# EasyEDA schematic DD M.json
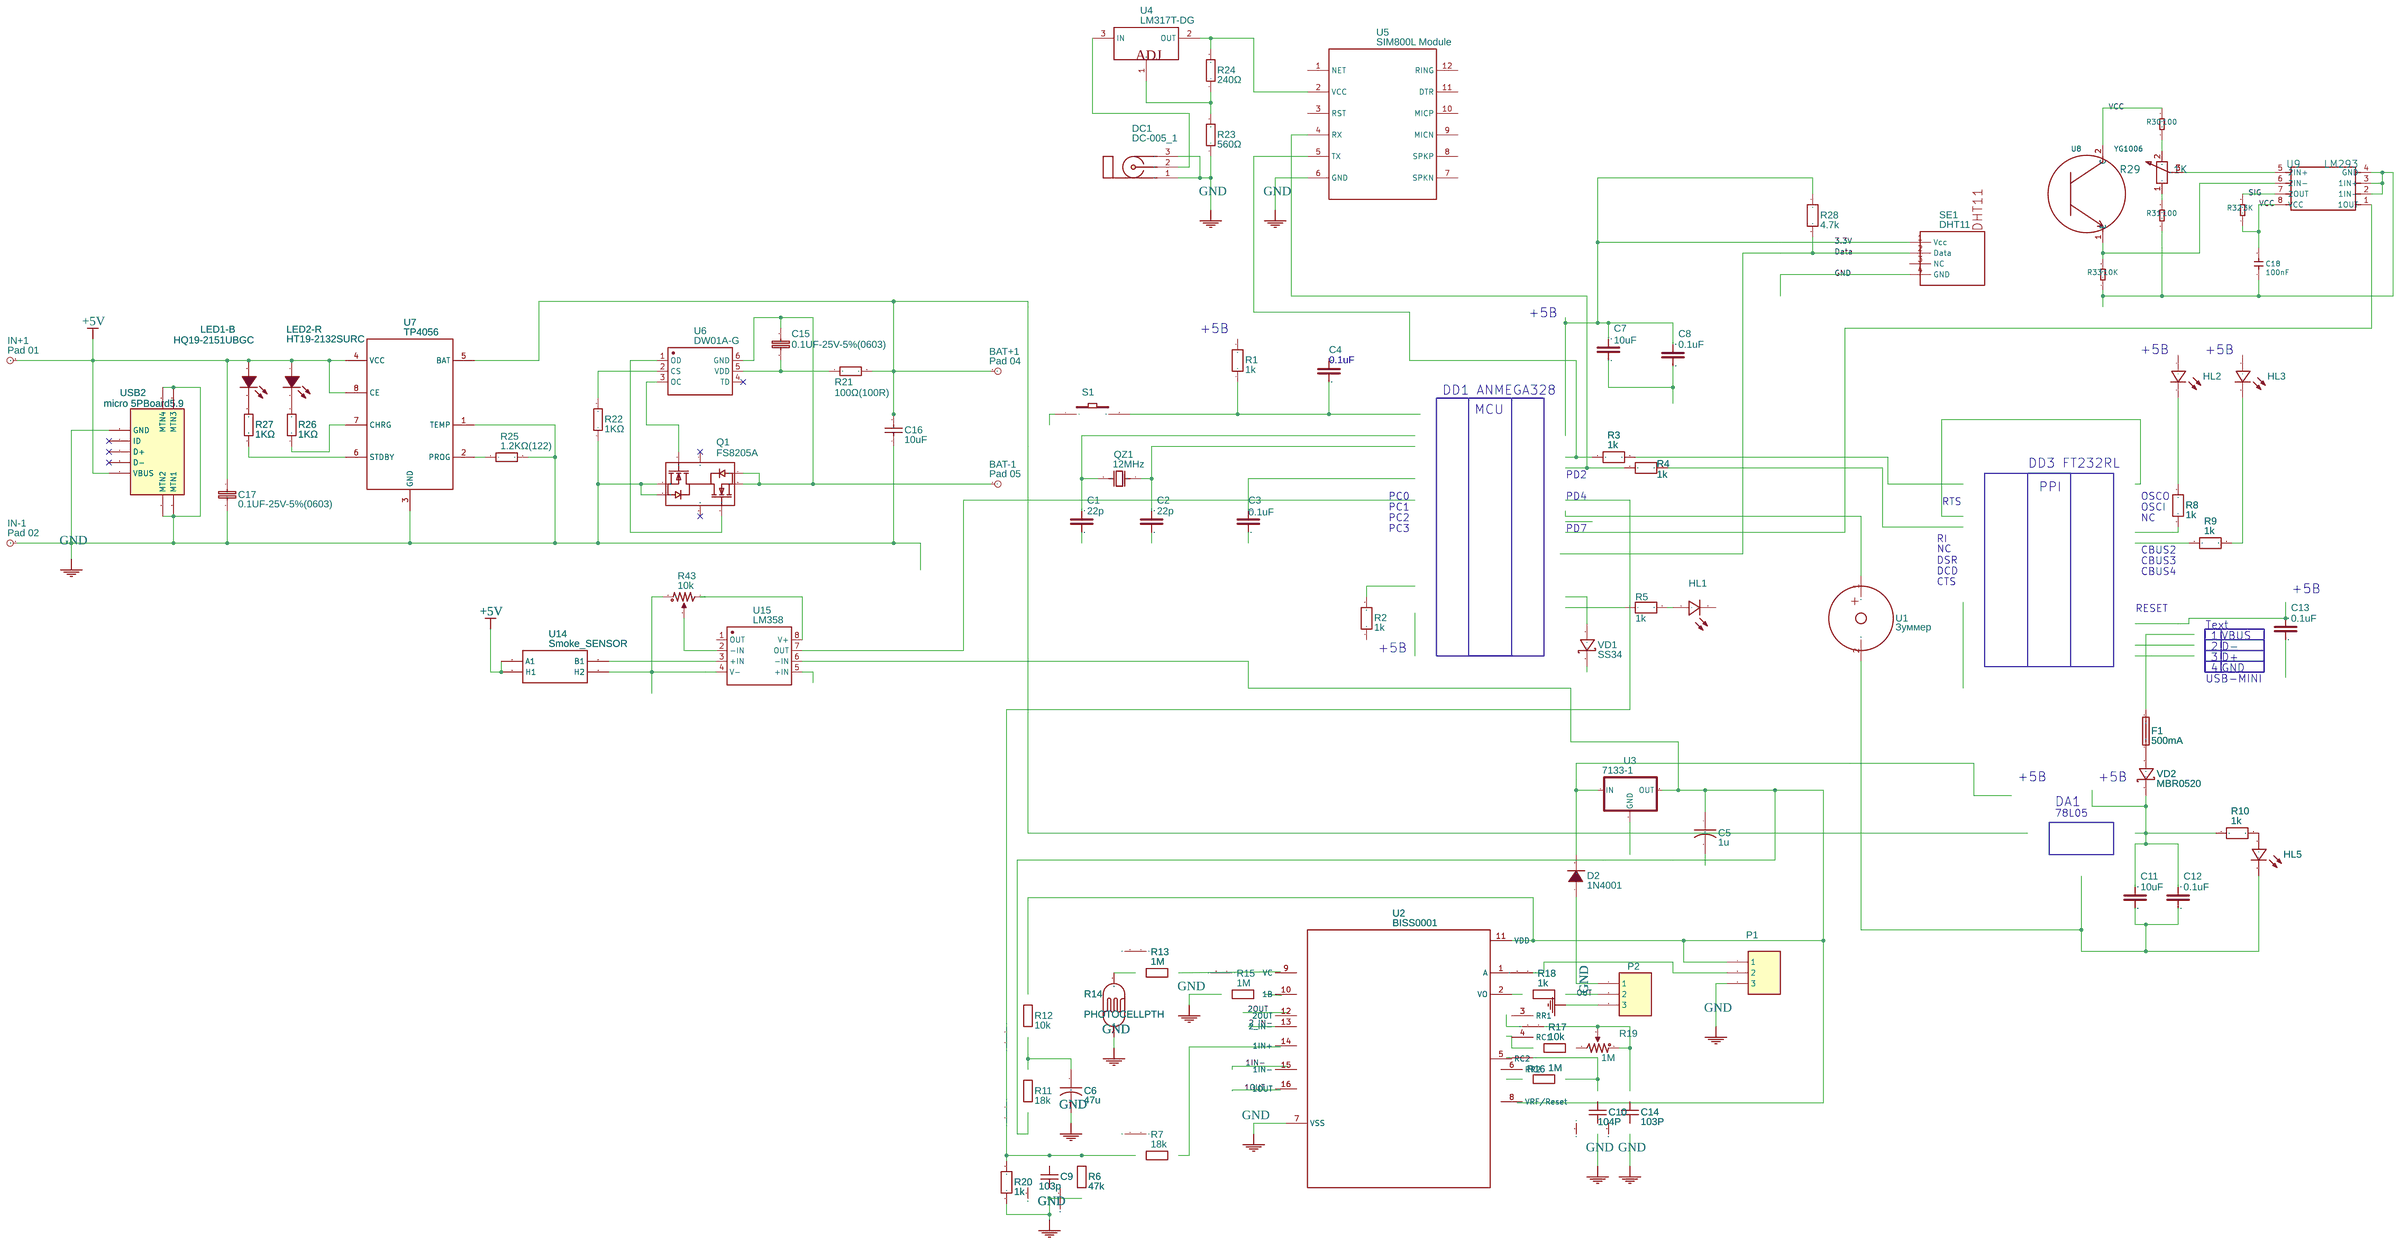
[diagram p0: schematic sheet]

## Parts
BAT+1  Pad 04  [CON_PAD_SQUARE_32MIL]
BAT-1  Pad 05  [CON_PAD_SQUARE_32MIL]
C1  22p  [TWO_IO]
C2  22p  [TWO_IO]
C3  0.1uF  [TWO_IO]
C4  Condensator1  [TWO_IO]
C5  1u  [DO-7]
C6  47u  [DO-7]
C7  10uF  [TWO_IO]
C8  0.1uF  [TWO_IO]
C9  103p  [C1]
C10  104P  [C0805]
C11  10uF  [TWO_IO]
C12  0.1uF  [TWO_IO]
C13  0.1uF  [TWO_IO]
C14  103P  [C0805]
C15  0.1UF-25V-5%(0603)  [0603-CAP]
C16  10uF  [0603]
C17  0.1UF-25V-5%(0603)  [0603-CAP]
C18  100nF  [C0603]
D2  1N4001  [DO35-7]
DC1  DC-005_1  [DC-005]
F1  500mA  [2A-3F-250VAC]
HL1  LED-3MM  [LED-3MM/2.54]
HL2  LED-3MM  [LED-3MM/2.54]
HL3  LED-3MM  [LED-3MM/2.54]
HL5  LED-3MM  [LED-3MM/2.54]
IN+1  Pad 01  [CON_PAD_SQUARE_32MIL]
IN-1  Pad 02  [CON_PAD_SQUARE_32MIL]
LED1-B  HQ19-2151UBGC  [LED-0603]
LED2-R  HT19-2132SURC  [LED-0603]
P1  SIP3  [HDR1X3]
P2  SIP3  [HDR1X3]
Q1  FS8205A  [TSSOP-8_3X4.4X065P]
QZ1  12MHz  [OSC-49S-1]
R1  1k  [AXIAL-0.3]
R2  1k  [AXIAL-0.3]
R3  1k  [AXIAL-0.3]
R4  1k  [AXIAL-0.3]
R5  1k  [AXIAL-0.3]
R6  47k  [C0805]
R7  18k  [C0805]
R8  1k  [AXIAL-0.3]
R9  1k  [AXIAL-0.3]
R10  1k  [AXIAL-0.3]
R11  18k  [C0805]
R12  10k  [C0805]
R13  1M  [C0805]
R14  PHOTOCELLPTH  [PHOTOCELL]
R15  1M  [C0805]
R16  1M  [C0805]
R17  10k  [C0805]
R18  1k  [C0805]
R19  1M  [TRIM_POT_PTH]
R20  1k  [AXIAL-0.3]
R21  100Ω(100R)  [0603]
R22  1KΩ  [0603]
R23  560Ω  [AXIAL-0.4]
R24  240Ω  [AXIAL-0.4]
R25  1.2KΩ(122)  [0603]
R26  1KΩ  [0603]
R27  1KΩ  [0603]
R28  4.7k  [AXIAL-0.3]
R29  1K  [3P-SQUA-7X6.8]
R30  100  [R0603]
R31  100  [R0603]
R32  3K  [R0603]
R33  10K  [R0603]
R43  10k  [TRIM_POT_PTH]
S1  EVQ22705R  [KEY-6.0*6.0-4]
SE1  DHT11  [HDR1X4]
U1  Зуммер  [ЗУММЕР]
U2  BISS0001  [DIP]
U3  7133-1  [SOT23]
U4  LM317T-DG  [TO-220(TO-220-3)]
U5  SIM800L Module  [SIM800L MODULE]
U6  DW01A-G  [SOT-23-6]
U7  TP4056  [SOP-8_EP_150MIL]
U8  YG1006  [2P-2.54-5MM]
U9  LM293  [SOIC8-6.0]
U14  Smoke_SENSOR  [MQ-3]
U15  LM358  [DIP8]
USB2  micro 5PBoard5.9  [MICRO-USB-1]
VD1  SS34  [SMA(DO-214AC)]
VD2  MBR0520  [SMA(DO-214AC)]

## Library data of the parts
BAT+1 BAT-1 IN+1 IN-1 = -: Contributor: DangerousPrototype; Manufacturer Part: ?
C1-C4 C7 C8 C11-C13 = -: Contributor: paulheystee; Manufacturer Part: ?
C5 C6 C9 C10 C14 = Capacitor: Manufacturer Part: ?
C15 C17 = -: Contributor: SparkFun; Manufacturer Part: ?
C16 = 0603X106K160NT: Supplier: LCSC; Manufacturer: FH; Tolerance: ±10%; Rated Voltage: 16V; Supplier Part: C70225
D2 = Diode: Manufacturer Part: ?
DC1 = -: Supplier: EasyEDA; Manufacturer: EasyEDA; Supplier Part: E66437
F1 = -: Supplier: LCSC; Manufacturer Part: Glass tube fuse2A 3F 250VAC; Manufacturer: XCFuse; image: //image.lceda.cn/szlcsc/C71017.jpg; Supplier Part: C71017
HL1-HL3 HL5 = -: Supplier: LCSC; Manufacturer: EVERLIGHT; Manufacturer Part: 204-10SURD/S530-A3; Supplier Part: C99772
LED1-B = -: Supplier: LCSC; Manufacturer: HARVATEK; Contributor: LCSC; Supplier Part: C154450
LED2-R = -: Supplier: LCSC; Manufacturer: HARVATEK; Contributor: LCSC; Supplier Part: C154453
P1 P2 = -: catid: 20; Manufacturer Part: ?
Q1 = -: Supplier: LCSC; Manufacturer: FORTUNE; LCSC Assembly: Yes; image: //image.lceda.cn/szlcsc/C16052.jpg; Supplier Part: C16052
QZ1 = X49SD12MSD2SC: Supplier: LCSC; Manufacturer: YXC; Supplier Part: C16369
R1-R5 R8 R9 R28 = Res_AXIAL-0.3(1/8W)_EU: Manufacturer Part: ?
R6 R7 R11-R13 R15-R18 = Resistor: Manufacturer Part: ?
R10 R20 = Res_AXIAL-0.3(1/8W)_EU
R14 = -: CdS photoresistor. This is a low cost way to detect light levels. Resistance decreases with more incoming light. SparkFun SKU: SEN-09088; catid: 20; Contributor: SparkFun; sourceId: tW8IiSrpZ; Manufacturer Part: ?
R19 R43 = Potentiometer: K(%): 50; Manufacturer Part: ?
R21 = AC0603FR-07100RL: Supplier: LCSC; Manufacturer: YAGEO; Power (Watts): 1/10W; Tolerance: ±1%; Supplier Part: C125923
R22 R26 R27 = RC0603FR-071KL: Supplier: LCSC; Manufacturer: YAGEO; Power (Watts): 1/10W; Tolerance: ±1%; Supplier Part: C22548
R23 = -: Power: 1/4W; Tolerance: ±1%; Supplier: EasyEDA; Manufacturer: UniOhm; Manufacturer Part: MFR0W4F5600A50; Supplier Part: E58635
R24 = -: Power: 1/4W; Tolerance: ±1%; Supplier: EasyEDA; Manufacturer: UniOhm; Manufacturer Part: MFR0W4F2400A50; Supplier Part: E58132
R25 = RC0603JR-071K2L: Supplier: LCSC; Manufacturer: YAGEO; Power (Watts): 1/10W; Tolerance: ±5%; Supplier Part: C114679
S1 = -: Supplier: LCSC; Manufacturer: PANASONIC; Contributor: LCSC; Supplier Part: C79156
SE1 = DHT11: catid: 20; Contributor: Unilein; sourceId: skQKDVdvN; Manufacturer Part: ?
U1 = -: Contributor: centr rek
U2 = -: Contributor: undefined; sourceId: ahRPpnI42; Manufacturer Part: ?
U3 = 78XX: catid: 20; Manufacturer Part: ?
U4 = -: Supplier: EasyEDA; Manufacturer: ST; Supplier Part: E18718
U5 = -: sourceId: ega4lDVPJ; Supplier: Amazon; Manufacturer Part: ?; Supplier Part: B01DLIJM2E
U6 = -: Supplier: LCSC; Manufacturer: FORTUNE; Contributor: LCSC; Supplier Part: C61503
U7 = -: Contributor: Guest; Supplier: LCSC; Manufacturer: TOPPOWER; LCSC Assembly: Yes; image: //image.lceda.cn/szlcsc/C16581.jpg; Supplier Part: C16581
U14 = -: MQ-3 alcohol gas sensor . FP not tested. SEN-08880.; catid: 20; Contributor: SparkFun; sourceId: FVTRPyUgC; Manufacturer Part: ?
U15 = -: sourceId: Dk8IGgdN9; Manufacturer Part: ?
USB2 = -: Supplier: LCSC; Manufacturer: ValuePro; image: //image.lceda.cn/szlcsc/C40953.jpg; Supplier Part: C40953
VD1 = -: Supplier: LCSC; Manufacturer: MDD; image: //image.lceda.cn/szlcsc/C8678.jpg; Supplier Part: C8678; LCSC Assembly: Yes; SMT Type: Extend
VD2 = -: Supplier: LCSC; Manufacturer Part: SS34; Manufacturer: MDD; image: //image.lceda.cn/szlcsc/C8678.jpg; Supplier Part: C8678; LCSC Assembly: Yes; SMT Type: Extend

## Nets
3.3V: C7.P$2 C8.P$2 R28.1 SE1.1(Vcc)
+5V: C17.1 IN+1.P LED1-B.1(A) LED2-R.1(A) U7.4(VCC) U7.8(CE) U14.A1 U14.HA(H1) USB2.1(VBUS)
GND: C6.2 C9.1 C10.1 C14.1 C16.1 C17.2 DC1.1 DC1.3 IN-1.P P1.3 P2.3 Q1.2(S1) Q1.3(S1) R6.1 R14.1(P$1) R15.1 R20.1 R22.1 R23.1 R25.2 SE1.4(GND) U2.7(VSS) U5.6(GND) U7.1(TEMP) U7.3(GND) USB2.0(MTN1) USB2.5(GND)
VCC: C18.2 R30.2 R32.1 U8.2(C) U9.8(VCC)
Data: R28.2 SE1.2(Data)
OUT: P2.2 R18.2
SIG: R32.2 U9.7(2OUT)
Net-(BAT+1-P): BAT+1.P C16.2 R21.2 U7.5(BAT)
Net-(BAT-1-P): BAT-1.P C15.1 Q1.6(S2) Q1.7(S2) U6.6(GND)
Net-(C1-P$2): C1.P$2 QZ1.2(OSC2)
Net-(C2-P$2): C2.P$2 QZ1.1(OSC1)
Net-(C4-P$1): C4.P$1 R1.1 S1.2
Net-(C5-1): C5.1 P1.1 R11.1 R12.2 U2.8(VRF/Reset) U2.11(VDD) U3.3(OUT) U15.6(-IN)
Net-(C6-1): C6.1 R11.2 R12.1
Net-(C7-P$1): C7.P$1 C8.P$1
Net-(C9-2): C9.2 R6.2 R7.1 R20.2
Net-(C10-2): C10.2 R16.2 U2.5(RC2)
Net-(C11-P$1): C11.P$1 C12.P$1 HL5.2(-) U1.2
Net-(C11-P$2): C11.P$2 C12.P$2 R10.1 VD2.2(K)
Net-(C14-2): C14.2 R19.2(3) R19.3(2) U2.3(RR1)
Net-(C15-2): C15.2 R21.1 U6.5(VDD)
Net-(C18-1): C18.1 R31.1 R33.1 U9.2(1IN-) U9.3(1IN+) U9.4(GND)
Net-(D2-A): D2.A P2.1
Net-(D2-C): D2.C U3.1(IN)
Net-(DC1-2): DC1.2(VCC) U4.3(IN)
Net-(F1-1): F1.1 VD2.1(A)
Net-(HL1-1): HL1.1(+) R5.2
Net-(HL2-2): HL2.2(-) R8.1
Net-(HL3-2): HL3.2(-) R9.2
Net-(HL5-1): HL5.1(+) R10.2
Net-(LED1-B-2): LED1-B.2(K) R27.2
Net-(LED2-R-2): LED2-R.2(K) R26.2
Net-(P1-2): P1.2 U2.1(A)
Net-(Q1-4): Q1.4(G1) U6.3(OC)
Net-(Q1-5): Q1.5(G2) U6.1(OD)
Net-(R3-2): R3.2 U5.5(TX)
Net-(R4-2): R4.2 U5.4(RX)
Net-(R7-2): R7.2 U2.14(1IN+)
Net-(R13-1): R13.1 R14.2(P$2)
Net-(R13-2): R13.2 U2.9(VC)
Net-(R16-1): R16.1 U2.6(RR2)
Net-(R17-1): R17.1 U2.4(RC1)
Net-(R17-2): R17.2 R19.1
Net-(R18-1): R18.1 U2.2(VO)
Net-(R22-2): R22.2 U6.2(CS)
Net-(R23-2): R23.2 R24.1 U4.1(ADJ)
Net-(R24-2): R24.2 U4.2(OUT) U5.2(VCC)
Net-(R25-1): R25.1 U7.2(PROG)
Net-(R26-1): R26.1 U7.7(CHRG)
Net-(R27-1): R27.1 U7.6(STDBY)
Net-(R29-1): R29.1 R31.2
Net-(R29-2): R29.2 R30.1
Net-(R29-3): R29.3 U9.5(2IN+)
Net-(R33-2): R33.2 U8.1(E) U9.6(2IN-)
Net-(R43-1): R43.1 U15.8(V+)
Net-(R43-2): R43.2(3) U15.2(-IN)
Net-(R43-3): R43.3(2) U14.HB(H2) U15.4(V-)
Net-(U14-B1): U14.B1 U15.3(+IN)

Not connected (* = marked no-connect by the designer): C1 P$1; C2 P$1; C3 P$1 P$2; C4 P$2; C5 2; C13 P$1 P$2; F1 2; HL1 2(-); HL2 1(+); HL3 1(+); Q1 1(D12)* 8(D12)*; R1 2; R2 1 2; R3 1; R4 1; R5 1; R8 2; R9 1; R15 2; S1 1; SE1 3(NC); U1 1; U2 10(1B) 12(2OUT) 13(2 IN-) 15(1IN-) 16(1OUT); U3 2(GND); U5 1(NET) 3(RST) 7(SPKN) 8(SPKP) 9(MICN) 10(MICP) 11(DTR) 12(RING); U6 4(TD)*; U9 1(1OUT); U15 1(OUT) 5(+IN) 7(OUT); USB2 2(D-)* 3(D+)* 4(ID)*; VD1 1(A) 2(K)

## Notes on the sheet
- +5B
- +5B
- +5B
- +5B
- 0.1uF
- DD1 ANMEGA328
- MCU
- DD3 FT232RL
- PD2
- PPI
- PC0
- PD4
- RTS
- OSCO
- PC1
- PC2
- NC
- OSCI
- PC3
- PD7
- RI
- NC
- CBUS2
- DSR
- CBUS3
- CTS
- DCD
- CBUS4
- +5B
- RESET
- Text
- 1
- VBUS
- +5B
- 2
- 3
- D+
- D-
- 4
- GND
- USB-MINI
- +5B
- +5B
- DA1
- 78L05
